# Altium schematic sheet Standby_PS.SchDoc
size A1; SPICEModelCacheYQEDCYZF: <root> / <DocumentId>YQEDCYZF</DocumentId> / </root>
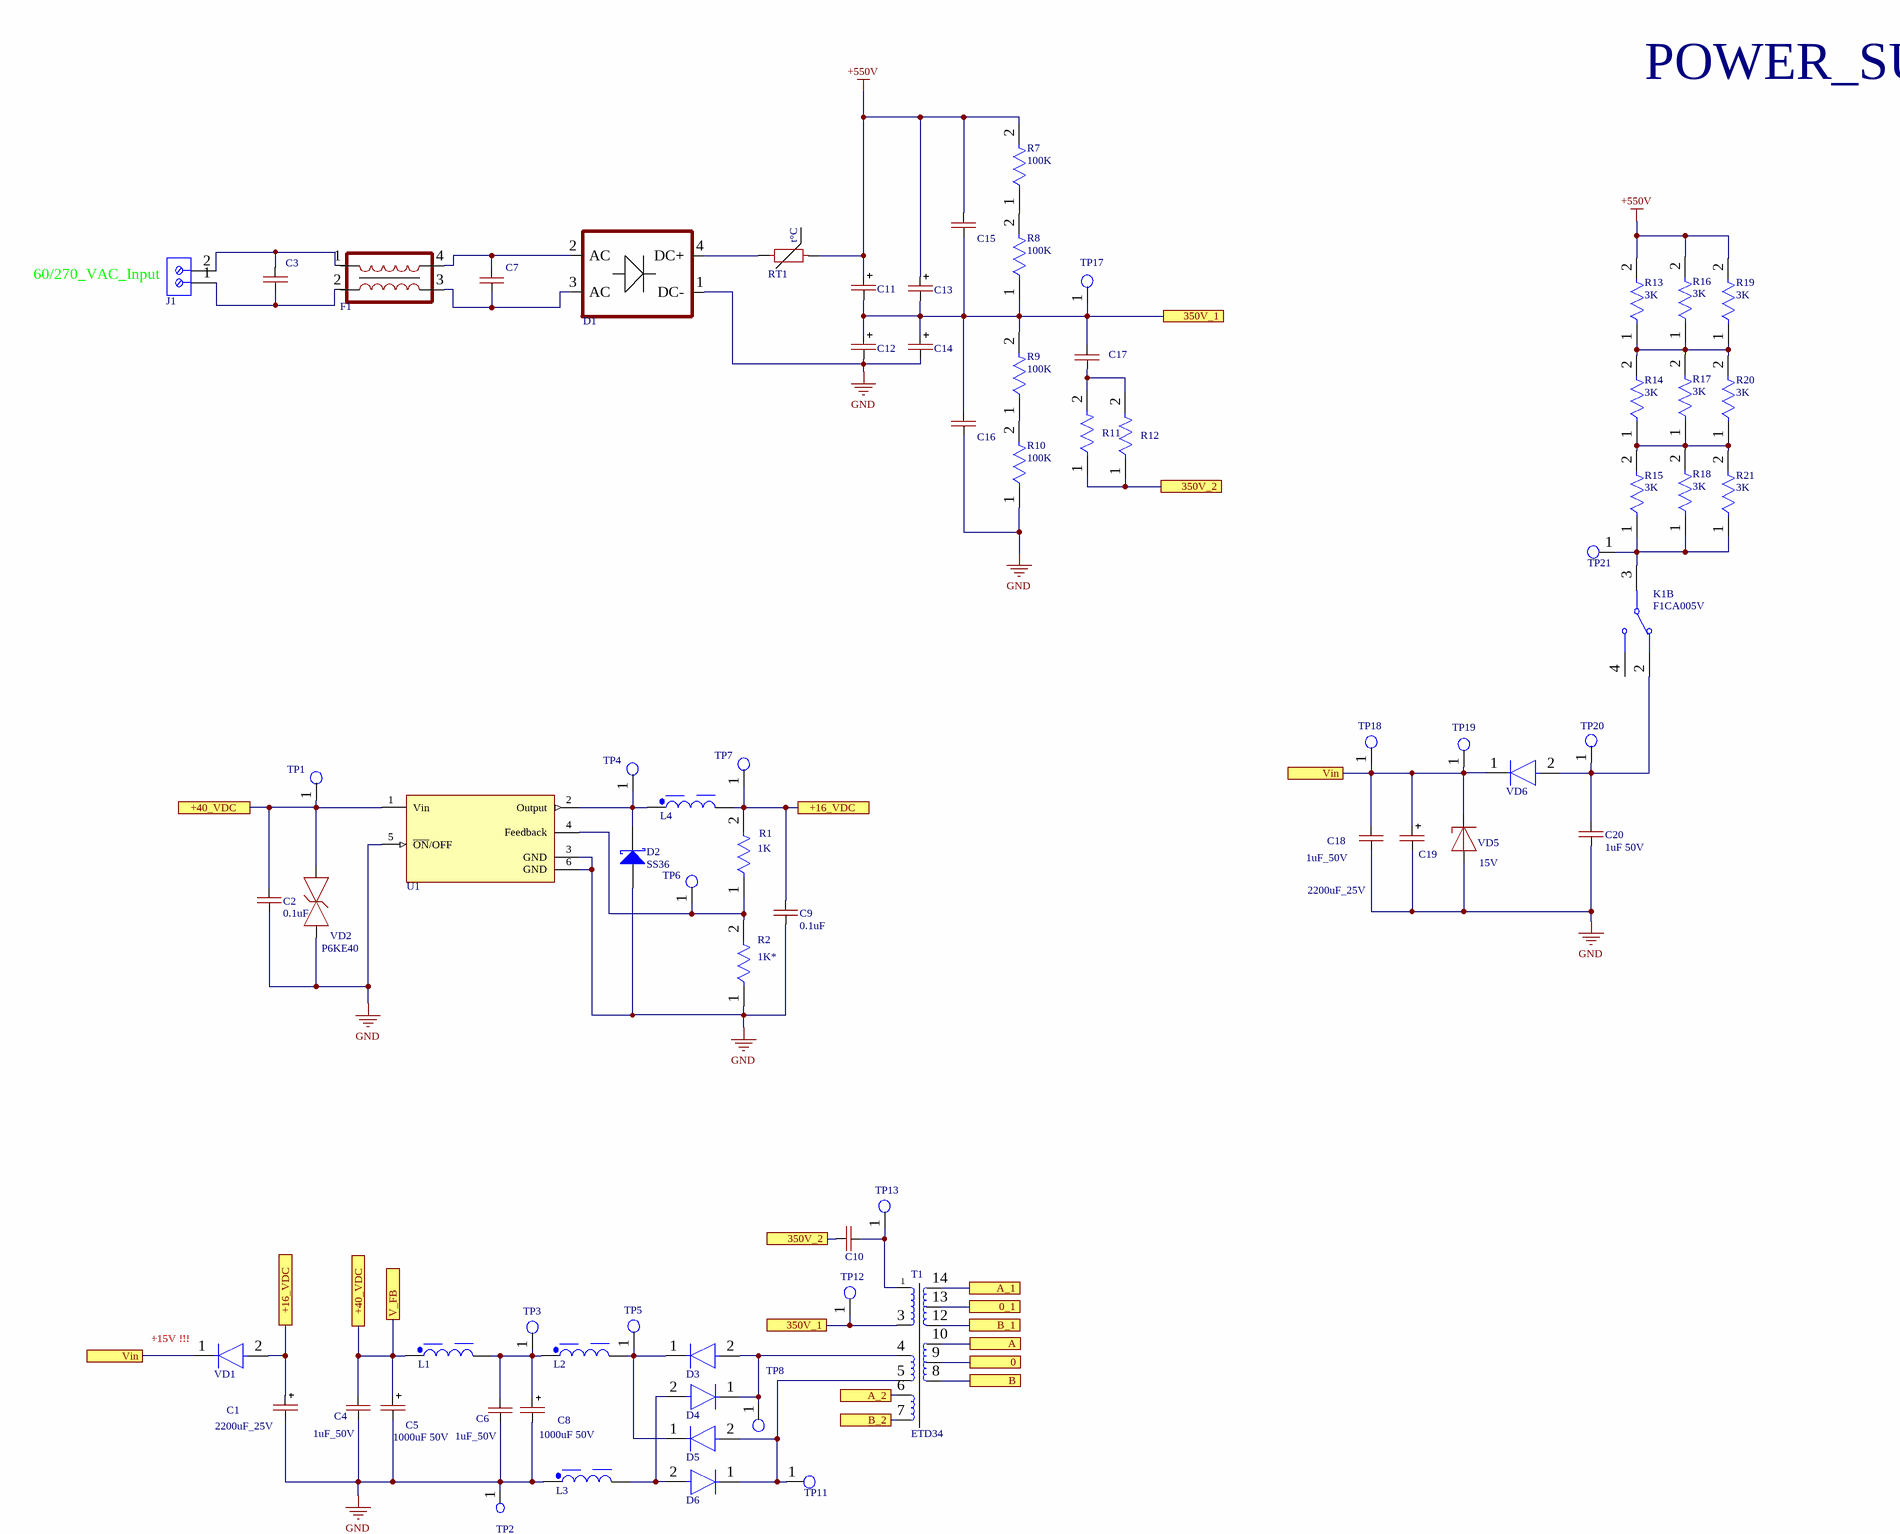
[diagram p0: Standby_PS.SchDoc, top left]
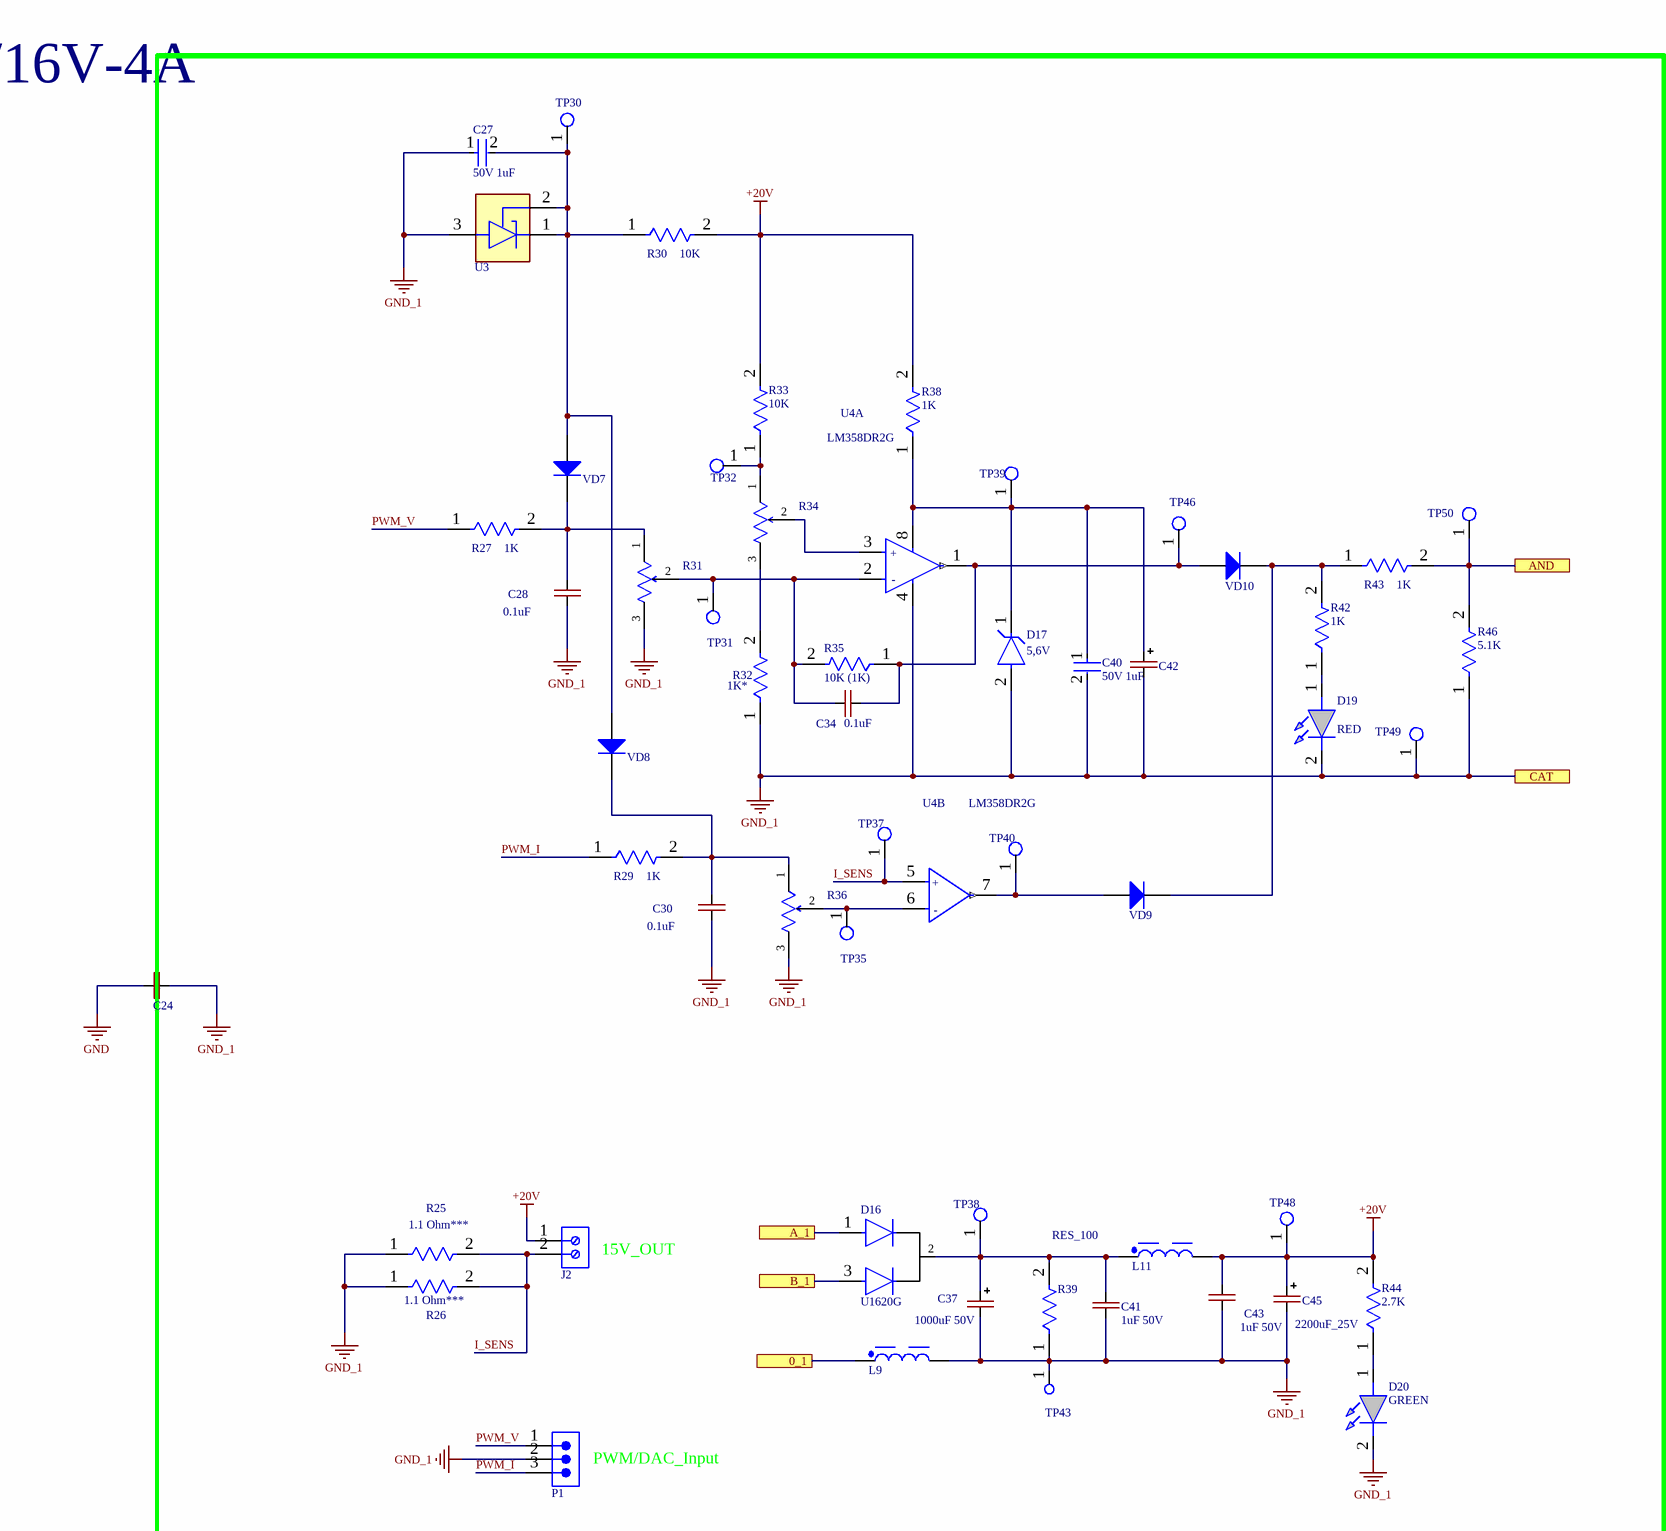
[diagram p1: Standby_PS.SchDoc, top right]
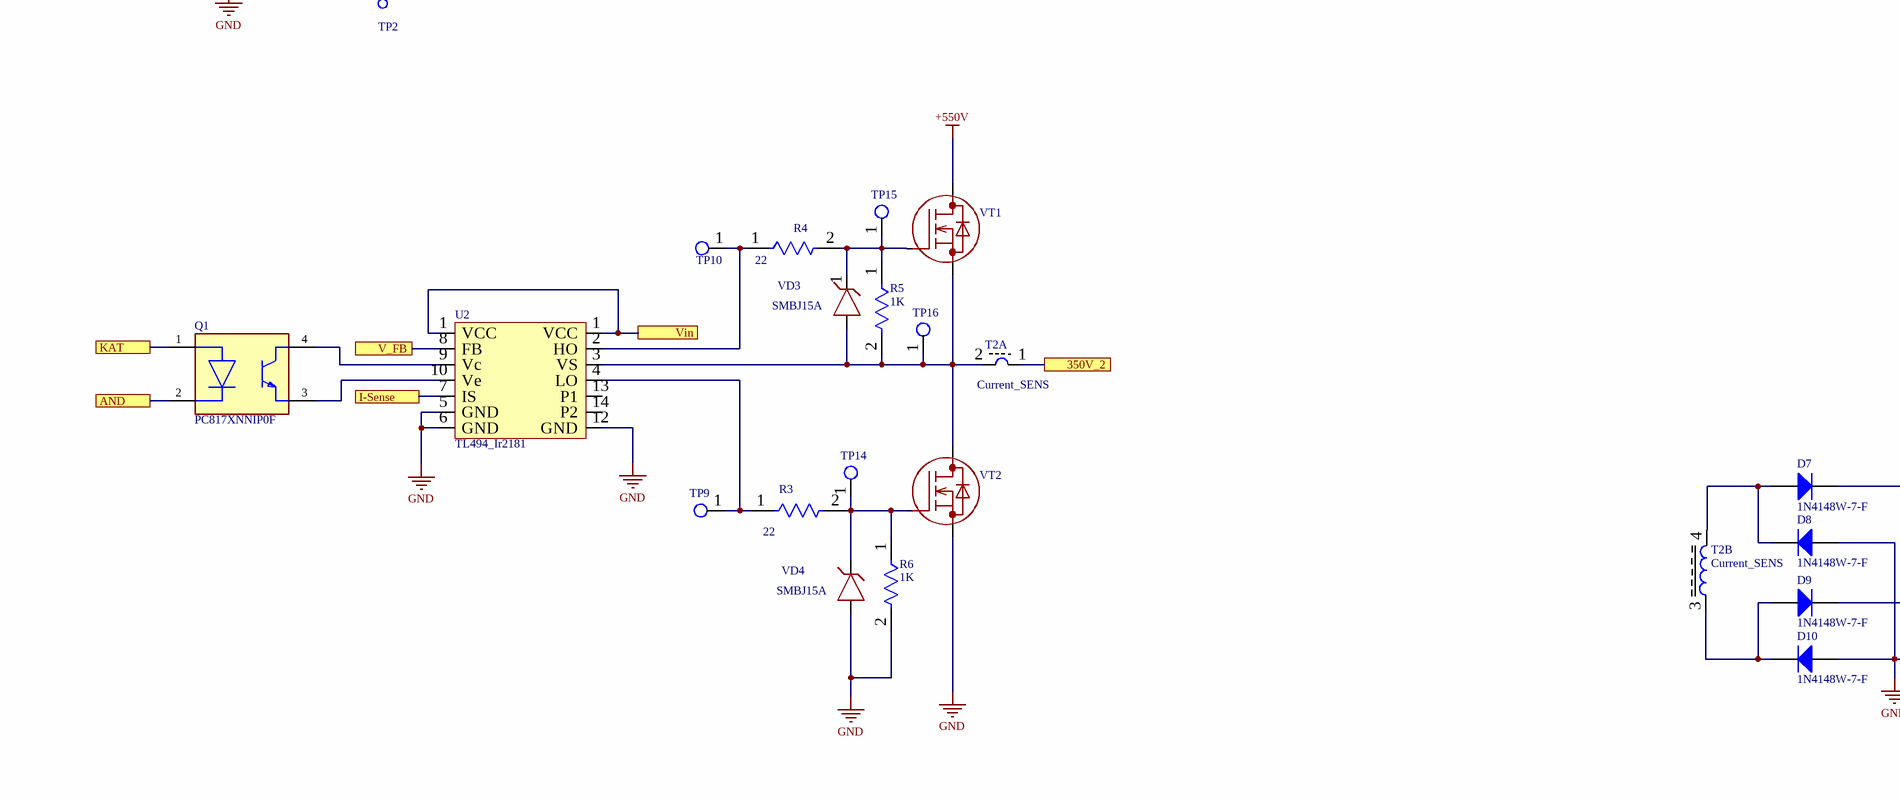
[diagram p2: Standby_PS.SchDoc, bottom left]
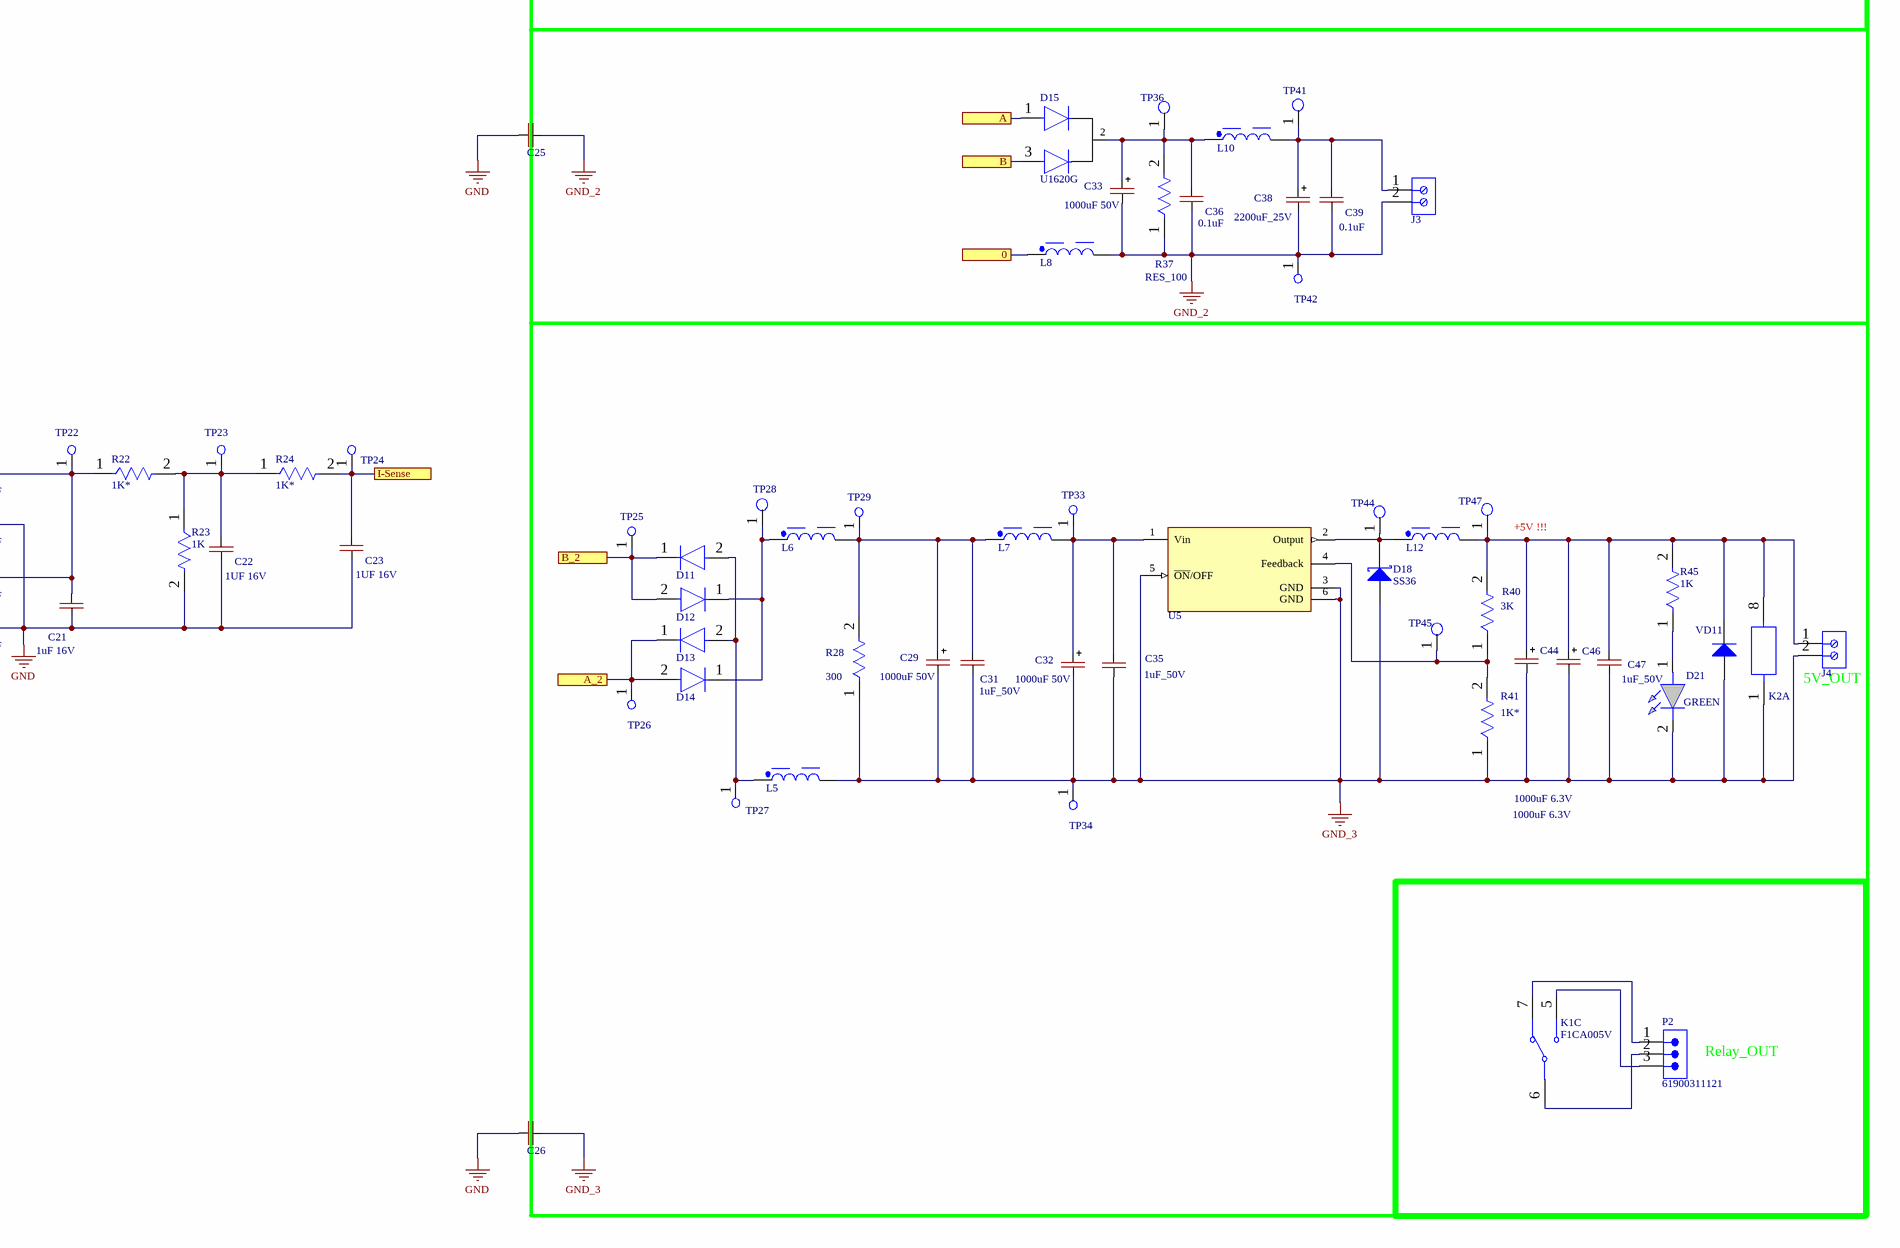
[diagram p3: Standby_PS.SchDoc, bottom right]

## Parts
C1  2200uF_25V  [CAP_POL_13x26_1000uF_50V]
C2  0.1uF  [CAP-0805]
C3  CAP-NON-POLAR  [CAP-V15]  (value not drawn)
C4  1uF_50V  [CAP-0805]
C5  1000uF 50V  [FP-RAD-TH-D_16_0_5-L_25_2-MFG]
C6  1uF_50V  [CAP-0805]
C7  CAP-NON-POLAR  [CAP-V15]  (value not drawn)
C8  1000uF 50V  [FP-RAD-TH-D_16_0_5-L_25_2-MFG]
C9  0.1uF  [CAP-0805]
C10  CAP-NON-POLAR  [CAP_3.3uF_630V]  (value not drawn)
C11  CAP-POLAR  [CAP 100uF_500V 22x40mm]  (value not drawn)
C12  CAP-POLAR  [CAP 100uF_500V 22x40mm]  (value not drawn)
C13  CAP-POLAR  [CAP 100uF_500V 22x40mm]  (value not drawn)
C14  CAP-POLAR  [CAP 100uF_500V 22x40mm]  (value not drawn)
C15  CAP-NON-POLAR  [CAP_3.3uF_630V]  (value not drawn)
C16  CAP-NON-POLAR  [CAP_3.3uF_630V]  (value not drawn)
C17  CAP-V  [CAP-V]  (value not drawn)
C18  1uF_50V  [CAP-0805]
C19  2200uF_25V  [CAP_POL_13x26_1000uF_50V]
C20  1uF 50V  [CAP-0805]
C21  1uF 16V  [CAP-0805]
C22  1UF 16V  [CAP-0805]
C23  1UF 16V  [CAP-0805]
C24  (no value)  [CAP-V]
C25  (no value)  [CAP-V]
C26  (no value)  [CAP-V]
C27  50V 1uF  [FP-C0805C-DN-IPC_A]
C28  0.1uF  [CAP-0805]
C29  1000uF 50V  [FP-RAD-TH-D_16_0_5-L_25_2-MFG]
C30  0.1uF  [CAP-0805]
C31  1uF_50V  [CAP-0805]
C32  1000uF 50V  [FP-RAD-TH-D_16_0_5-L_25_2-MFG]
C33  1000uF 50V  [FP-RAD-TH-D_16_0_5-L_25_2-MFG]
C34  0.1uF  [CAP-0805]
C35  1uF_50V  [CAP-0805]
C36  0.1uF  [CAP-0805]
C37  1000uF 50V  [FP-RAD-TH-D_16_0_5-L_25_2-MFG]
C38  2200uF_25V  [CAPPOL-12x25]
C39  0.1uF  [CAP-0805]
C40  50V 1uF  [FP-C0805C-DN-IPC_A]
C41  1uF 50V  [CAP-0805]
C42  CAP-POLAR  [CAP-TAN-C]  (value not drawn)
C43  1uF 50V  [CAP-0805]
C44  1000uF 6.3V  [CAP_SMD_Size_E]
C45  2200uF_25V  [CAPPOL-12x25]
C46  1000uF 6.3V  [CAP_SMD_Size_E]
C47  1uF_50V  [CAP-0805]
D1  RS40X  [RS40X]  (value not drawn)
D2  SS36  [SMC/DO214AB]
D3  US1G  [DO-214AA]  (value not drawn)
D4  US1G  [DO-214AA]  (value not drawn)
D5  US1G  [DO-214AA]  (value not drawn)
D6  US1G  [DO-214AA]  (value not drawn)
D7  1N4148W-7-F  [DIOD-SOD123-2_V]
D8  1N4148W-7-F  [DIOD-SOD123-2_V]
D9  1N4148W-7-F  [DIOD-SOD123-2_V]
D10  1N4148W-7-F  [DIOD-SOD123-2_V]
D11  US1G  [DO-214AA]  (value not drawn)
D12  US1G  [DO-214AA]  (value not drawn)
D13  US1G  [DO-214AA]  (value not drawn)
D14  US1G  [DO-214AA]  (value not drawn)
D15  U1620G  [TO-220_Bended_Rad]
D16  U1620G  [TO-220_Bended_Rad]
D17  5,6V  [FP-SB-V-3906_04-031_4-MFG]
D18  SS36  [SMC/DO214AB]
D19  RED  [LED_RED]
D20  GREEN  [LED_GREEN]
D21  GREEN  [LED_GREEN]
F1  FILTER  [FILTER_1]  (value not drawn)
J1  691101710002  [691101710002]  (value not drawn)
J2  691102710002  [691102710002]  (value not drawn)
J3  691102710002  [691102710002]  (value not drawn)
J4  691101710002  [691101710002]  (value not drawn)
K1  F1CA005V  [Relay_F1CA005V_Omron]  (parts B,C of 3)
K2  (no value)  [Relay_F1CA005V_Omron]  (part A of 3)
L1  1.2µH, 7.4A  [WE-PD2_1054]  (value not drawn)
L2  1.2µH, 7.4A  [WE-PD2_1054]  (value not drawn)
L3  1.2µH, 7.4A  [WE-PD2_1054]  (value not drawn)
L4  22µH, 2.04A  [WE-PD2_1054]  (value not drawn)
L5  1.2µH, 7.4A  [WE-PD2_1054]  (value not drawn)
L6  1.2µH, 7.4A  [WE-PD2_1054]  (value not drawn)
L7  1.2µH, 7.4A  [WE-PD2_1054]  (value not drawn)
L8  1.2µH, 7.4A  [WE-PD2_1054]  (value not drawn)
L9  1.2µH, 7.4A  [WE-PD2_1054]  (value not drawn)
L10  1.2µH, 7.4A  [WE-PD2_1054]  (value not drawn)
L11  1.2µH, 7.4A  [WE-PD2_1054]  (value not drawn)
L12  22µH, 2.04A  [WE-PD2_1054]  (value not drawn)
P1  61900311121  [61900311121]  (value not drawn)
P2  61900311121  [61900311121]
Q1  PC817XNNIP0F  [FP-PC817XNNIP0F-MFG]
R1  1K  [RES-0805]
R2  1K*  [RES-0805]
R3  22  [RES_SMD_1210_IPC_A]
R4  22  [RES_SMD_1210_IPC_A]
R5  1K  [RES-0805]
R6  1K  [RES-0805]
R7  100K  [RES-2512]
R8  100K  [RES-2512]
R9  100K  [RES-2512]
R10  100K  [RES-2512]
R11  RES_1210  [RES_SMD_1210_IPC_A]  (value not drawn)
R12  RES_1210  [RES_SMD_1210_IPC_A]  (value not drawn)
R13  3K  [RES-2512]
R14  3K  [RES-2512]
R15  3K  [RES-2512]
R16  3K  [RES-2512]
R17  3K  [RES-2512]
R18  3K  [RES-2512]
R19  3K  [RES-2512]
R20  3K  [RES-2512]
R21  3K  [RES-2512]
R22  1K*  [RES-0805]
R23  1K  [RES-0805]
R24  1K*  [RES-0805]
R25  1.1 Ohm***  [RES-2W_2]
R26  1.1 Ohm***  [RES-2W_2]
R27  1K  [RES-0805]
R28  300  [RES_3W]
R29  1K  [RES-0805]
R30  10K  [RES-0805]
R31  10K  [RES_Adj_3296W_Bourns]  (value not drawn)
R32  1K*  [RES-0805]
R33  10K  [RES-0805]
R34  10K  [RES_Adj_3296W_Bourns]  (value not drawn)
R35  10K (1K)  [RES-0805]
R36  10K  [RES_Adj_3296W_Bourns]  (value not drawn)
R37  RES_100  [RES_3W]
R38  1K  [RES-0805]
R39  RES_100  [RES_3W]
R40  3K  [RES-0805]
R41  1K*  [RES-0805]
R42  1K  [RES-0805]
R43  1K  [RES-0805]
R44  2.7K  [RES-0805]
R45  1K  [RES-0805]
R46  5.1K  [RES-0805]
RT1  RES-TEMP  [10D-15]  (value not drawn)
T1  ETD34  [Transformer_ETD34]
T2  Current_SENS  [Current_Sense_13x7x5]  (parts A,B of 2)
TP1  (no value)  [Test_Point]
TP2  Test_Point_PCB  [Pin_Test_Point(Orange)]  (value not drawn)
TP3  (no value)  [Test_Point]
TP4  (no value)  [Test_Point]
TP5  (no value)  [Test_Point]
TP6  (no value)  [Test_Point]
TP7  (no value)  [Test_Point]
TP8  (no value)  [Test_Point]
TP9  (no value)  [Test_Point]
TP10  (no value)  [Test_Point]
TP11  (no value)  [Test_Point]
TP12  (no value)  [Test_Point]
TP13  (no value)  [Test_Point]
TP14  (no value)  [Test_Point]
TP15  (no value)  [Test_Point]
TP16  (no value)  [Test_Point]
TP17  (no value)  [Test_Point]
TP18  (no value)  [Test_Point]
TP19  Test_Point_PCB  [Test_Point]  (value not drawn)
TP20  Test_Point_PCB  [Test_Point]  (value not drawn)
TP21  Test_Point_PCB  [Test_Point]  (value not drawn)
TP22  Test_Point_PCB  [Test_Point]  (value not drawn)
TP23  Test_Point_PCB  [Test_Point]  (value not drawn)
TP24  Test_Point_PCB  [Test_Point]  (value not drawn)
TP25  Test_Point_PCB  [Test_Point]  (value not drawn)
TP26  Test_Point_PCB  [Test_Point]  (value not drawn)
TP27  Test_Point_PCB  [Test_Point]  (value not drawn)
TP28  (no value)  [Test_Point]
TP29  Test_Point_PCB  [Test_Point]  (value not drawn)
TP30  Test_Point_PCB  [Test_Point]  (value not drawn)
TP31  Test_Point_PCB  [Test_Point]  (value not drawn)
TP32  Test_Point_PCB  [Test_Point]  (value not drawn)
TP33  Test_Point_PCB  [Test_Point]  (value not drawn)
TP34  Test_Point_PCB  [Pin_Test_Point(Orange)]  (value not drawn)
TP35  Test_Point_PCB  [Test_Point]  (value not drawn)
TP36  Test_Point_PCB  [Test_Point]  (value not drawn)
TP37  Test_Point_PCB  [Test_Point]  (value not drawn)
TP38  Test_Point_PCB  [Test_Point]  (value not drawn)
TP39  Test_Point_PCB  [Test_Point]  (value not drawn)
TP40  Test_Point_PCB  [Test_Point]  (value not drawn)
TP41  Test_Point_PCB  [Test_Point]  (value not drawn)
TP42  Test_Point_PCB  [Pin_Test_Point(Pink)]  (value not drawn)
TP43  Test_Point_PCB  [Pin_Test_Point(Pink)]  (value not drawn)
TP44  (no value)  [Test_Point]
TP45  (no value)  [Test_Point]
TP46  Test_Point_PCB  [Test_Point]  (value not drawn)
TP47  (no value)  [Test_Point]
TP48  Test_Point_PCB  [Test_Point]  (value not drawn)
TP49  Test_Point_PCB  [Test_Point]  (value not drawn)
TP50  Test_Point_PCB  [Test_Point]  (value not drawn)
U1  (no value)  [ON_Semiconductor_936A-02_MFG]
U2  TL494_Ir2181  [PWM_Controller_Half]
U3  (no value)  [TL431_SOT-23-3(A)]
U4  LM358DR2G  [FP-751-07-IPC_C]  (parts A,B of 2)
U5  (no value)  [ON_Semiconductor_936A-02_MFG]
VD1  US1G  [US1G_SMA]  (value not drawn)
VD2  P6KE40  [P6KE350CA]
VD3  SMBJ15A  [DO-214AA]
VD4  SMBJ15A  [DO-214AA]
VD5  15V  [DO-017AA]
VD6  US1G  [US1G_SMA]  (value not drawn)
VD7  (no value)  [DIOD-SOD123-2_V]
VD8  (no value)  [DIOD-SOD123-2_V]
VD9  (no value)  [DIOD-SOD123-2_V]
VD10  (no value)  [DIOD-SOD123-2_V]
VD11  (no value)  [DIOD-SOD123-2_V]
VT1  MOSFET-N-GDS  [RAD_TO-220-TO247]  (value not drawn)
VT2  MOSFET-N-GDS  [RAD_TO-220-TO247]  (value not drawn)

## Blocks framed on the sheet
Relay_OUT: K1 P2

## Ports
0, 0_1, 350V_1, 350V_2, +16_VDC, +40_VDC, A, A_1, A_2, AND, B, B_1, B_2, CAT, I-Sense, KAT, V_FB, Vin

## Nets
+20V: C43.2 C45.1(+) J2.1 L11.2 R30.2 R33.2 R38.2 R44.2 TP48.1(G9)
+550V: C11.1(+) C13.1(+) C15.2 R7.2 R13.2 R16.2 R19.2 RT1.1 VT1.2(D)
GND: C1.2(-) C2.1 C4.2 C5.2(-) C6.2 C8.2(-) C9.1 C12.2(-) C14.2(-) C16.1 C18.2 C19.2(-) C20.1 C21.1 C22.1 C23.1 C24.1 C25.1 C26.1 D1.1(DC-) D2.2(A) D8.2(A) D10.2(A) L3.1 R2.1 R6.2 R10.1 R23.2 TP2.1(G9) U1.3(GND) U1.5(~{ON}/OFF) U1.6(GND) U2.5(GND) U2.6(GND) U2.12(GND) VD2.1(C) VD4.2(A) VD5.2(A) VT2.3(S)
GND_1: C24.2 C27.1 C28.1 C30.1 C37.2(-) C40.2 C41.1 C42.2(-) C43.1 C45.2(-) D17.2(A) D19.2(K) D20.2(K) L9.2 P1.2 R25.1 R26.1 R31.3(CW) R32.1 R36.3(CW) R39.1 R46.1 TP43.1(G9) TP49.1(G9) U3.3(A) U4.4(VEE/GND) ; port CAT
GND_2: C25.2 C33.2(-) C36.1 C38.2(-) C39.1 J3.2 L8.2 R37.1 TP42.1(G9)
GND_3: C26.2 C29.2(-) C31.2 C32.2(-) C35.2 C44.2(-) C46.2(-) C47.2 D18.2(A) D21.2(K) J4.2 K2.1 L5.2 R28.1 R41.1 TP34.1(G9) U5.3(GND) U5.5(~{ON}/OFF) U5.6(GND) VD11.2(A)
0: L8.1 T1.9 ; port 0
0_1: L9.1 T1.13 ; port 0_1
350V_1: C11.2(-) C12.1(+) C13.2(-) C14.1(+) C15.1 C16.2 C17.2 R8.1 R9.2 T1.3 TP12.1(G9) TP17.1(G9) ; port 350V_1
350V_2: C10.1 R11.1 R12.1 T2.1 ; port 350V_2
+16_VDC: C1.1(+) C9.2 L4.2 R1.2 TP7.1(G9) VD1.2(A) ; port +16_VDC
+40_VDC: C2.2 C4.1 C5.1(+) L1.1 TP1.1(G9) U1.1(Vin) U2.8(FB) VD2.2(A) ; port V_FB, port +40_VDC
A: D15.1(A) T1.10 ; port A
A_1: D16.1(A) T1.14 ; port A_1
A_2: D13.1(C) D14.2(A) T1.6 TP26.1(G9) ; port A_2
AND: Q1.2(C) R43.2 R46.2 TP50.1(G9) ; port AND
B: D15.3(A) T1.8 ; port B
B_1: D16.3(A) T1.12 ; port B_1
B_2: D11.1(C) D12.2(A) T1.7 TP25.1(G9) ; port B_2
I-Sense: C23.2 R24.2 TP24.1(G9) U2.7(IS) ; port I-Sense
I_SENS: J2.2 R25.2 R26.2 TP37.1(G9) U4.5(INPUT_B+)
KAT: Q1.1(A) ; port KAT
PWM_I: P1.3 R29.1
PWM_V: P1.1 R27.1
Vin: C18.1 C19.1(+) TP18.1(G9) TP19.1(G9) U2.1(VCC) VD1.1(C) VD5.1(C) VD6.1(C) ; port Vin
NetC3_1: C3.1 F1.2 J1.1
NetC3_2: C3.2 F1.1 J1.2
NetC6_1: C6.1 C8.1(+) L1.2 L2.1 TP3.1(G9)
NetC7_1: C7.1 D1.3(AC) F1.3
NetC7_2: C7.2 D1.2(AC) F1.4
NetC10_2: C10.2 T1.1 TP13.1(G9)
NetC17_1: C17.1 R11.2 R12.2
NetC20_2: C20.2 K1.2 TP20.1(G9) VD6.2(A)
NetC21_2: C21.2 D7.1(K) D9.1(K) R22.1 TP22.1(G9)
NetC22_2: C22.2 R22.2 R23.1 R24.1 TP23.1(G9)
NetC27_2: C27.2 R30.1 TP30.1(G9) U3.1(C) U3.2(REF) VD7.2(A) VD8.2(A)
NetC28_2: C28.2 R27.2 R31.1(CCW) VD7.1(K)
NetC29_1: C29.1(+) C31.1 L6.2 L7.1 R28.2 TP29.1(G9)
NetC30_2: C30.2 R29.2 R36.1(CCW) VD8.1(K)
NetC32_1: C32.1(+) C35.1 L7.2 TP33.1(G9) U5.1(Vin)
NetC33_1: C33.1(+) C36.2 D15.2(C) L10.1 R37.2 TP36.1(G9)
NetC34_1: C34.1 R35.1 TP46.1(G9) U4.1(OUTPUT_A) VD10.2(A)
NetC34_2: C34.2 R31.2(WIPER) R35.2 TP31.1(G9) U4.2(INPUT_A-)
NetC37_1: C37.1(+) C41.2 D16.2(C) L11.1 R39.2 TP38.1(G9)
NetC38_1: C38.1(+) C39.2 J3.1 L10.2 TP41.1(G9)
NetC40_1: C40.1 C42.1(+) D17.1(C) R38.1 TP39.1(G9) U4.8(VCC)
NetC44_1: C44.1(+) C46.1(+) C47.1 J4.1 K2.8 L12.2 R40.2 R45.2 TP47.1(G9) VD11.1(K)
NetD1_4: D1.4(DC+) RT1.2
NetD2_1: D2.1(K) L4.1 TP4.1(G9) U1.2(Output)
NetD3_1: D3.1(C) D5.1(C) L2.2 TP5.1(G9)
NetD3_2: D3.2(A) D4.1(C) T1.4 TP8.1(G9)
NetD4_2: D4.2(A) D6.2(A) L3.2
NetD5_2: D5.2(A) D6.1(C) T1.5 TP11.1(G9)
NetD7_2: D7.2(A) D8.1(K) T2.4
NetD9_2: D9.2(A) D10.1(K) T2.3
NetD11_2: D11.2(A) D13.2(A) L5.1 TP27.1(G9)
NetD12_1: D12.1(C) D14.1(C) L6.1 TP28.1(G9)
NetD18_1: D18.1(K) L12.1 TP44.1(G9) U5.2(Output)
NetD19_1: D19.1(A) R42.1
NetD20_1: D20.1(A) R44.1
NetD21_1: D21.1(A) R45.1
NetK1_3: K1.3 R15.1 R18.1 R21.1 TP21.1(G9)
NetK1_5: K1.5 P2.3
NetK1_6: K1.6 P2.2
NetK1_7: K1.7 P2.1
NetQ1_3: Q1.3(E) U2.10(Ve)
NetQ1_4: Q1.4(C) U2.9(Vc)
NetR1_1: R1.1 R2.2 TP6.1(G9) U1.4(Feedback)
NetR3_1: R3.1 TP9.1(G9) U2.4(LO)
NetR3_2: R3.2 R6.1 TP14.1(G9) VD4.1(C) VT2.1(G)
NetR4_1: R4.1 TP10.1(G9) U2.2(HO)
NetR4_2: R4.2 R5.1 TP15.1(G9) VD3.1(C) VT1.1(G)
NetR5_2: R5.2 T2.2 TP16.1(G9) U2.3(VS) VD3.2(A) VT1.3(S) VT2.2(D)
NetR7_1: R7.1 R8.2
NetR9_1: R9.1 R10.2
NetR13_1: R13.1 R14.2 R16.1 R17.2 R19.1 R20.2
NetR14_1: R14.1 R15.2 R17.1 R18.2 R20.1 R21.2
NetR32_2: R32.2 R34.3(CW)
NetR33_1: R33.1 R34.1(CCW) TP32.1(G9)
NetR34_2: R34.2(WIPER) U4.3(INPUT_A+)
NetR36_2: R36.2(WIPER) TP35.1(G9) U4.6(INPUT_B-)
NetR40_1: R40.1 R41.2 TP45.1(G9) U5.4(Feedback)
NetR42_2: R42.2 R43.1 VD9.1(K) VD10.1(K)
NetTP40_1: TP40.1(G9) U4.7(OUTPUT_B) VD9.2(A)

Not connected (* = marked no-connect by the designer): K1 4; U2 13(P1) 14(P2)

## Notes on the sheet
- POWER_SUPPLY 60-350V/16V-4A
- (near J1) 60/270_VAC_Input
- (near J2) 15V_OUT
- (near VD1) +15V !!!
- (near P1) PWM/DAC_Input
- (near TP47) +5V !!!
- (near J4) 5V_OUT
- (in symbol CMP-1310-00291-2, part A) +; -
- (in symbol CMP-1310-00291-2, part B) +; -
- (in symbol RES-TEMP) t°C

## Library data of the parts
C1 C19 = CAP_polar_Hitano
C2 C4 C6 C9 C18 C20-C23 C28 C30 C31 C34-C36 C39 C41 C43 C47 = CAP-NON-POLAR
C5 C8 C29 C32 C33 C37 C38 C45 = CAP-POLAR
C24-C26 = CAP-V
C27 C40 = CMP-1036-04552-2: CAP CER 0.22UF 50V X7R 0805; Manufacturer: KEMET; Manufacturer Part Number: C0805C224K5RACTU; Value: 0.22 μF; Temperature Coefficient: 30ppm/°C; Material: Ceramic; Tolerance: 0.1; ComponentLink2URL: https://content.kemet.com/datasheets/KEM_C1003_C0G_SMD.pdf; Temperature Characteristic: X7R; Device Class L3: Ceramic Capacitors; Lead Free: Yes; Temperature: -55°C to +125°C; RoHS: TRUE; Capacitance: 0.22 μF; Automotive: No; Octopart: https://octopart.com/c0805c224k5ractu-kemet-144670; Temperature Range Low: -55°C; Height: 0.88mm; Device Class L1: Passive Components; Digikey Description: CAP CER 0.22UF 50V X7R 0805; ComponentLink2Description: Datasheet; Mouser Description: CAP CER 0.22UF 50V X7R 0805; Category: Cap; Ipc Land Pattern Name: CAPC200125X78; Temperature Range High: +125°C; Package: C0805C-DN; Device Class L2: Capacitors; Voltage Rating: 50 V
C44 C46 = CAP_POL_SMD
D2 D18 = SS36_Schottky
D7-D10 VD7-VD11 = 1N4148: Fast Switching Diode, 100 V, 0.15 A, -65 to 150 degC, 2-Pin?SOD123, RoHS, Tape and Reel; Recovery Time: 4ns; Brand: DiodesIncorporated; Unit Weight: 0.000353oz; Max Surge Current: 2A; Peak Reverse Voltage: 100V; Ir - Reverse Current: 1uA; Vf - Forward Voltage: 1.25V; Configuration: Single; If - Forward Current: 0.15A; Product Category: Diodes-GeneralPurpose,Power,Switching; Operating Temperature Range: -65Cto+150C; Packaging: Reel; Manufacturer URL: http://www.diodes.com/; Maximum Operating Temperature: +150C; Height: 1.25mm; Minimum Operating Temperature: -65C; Product: SwitchingDiodes; Package URL: http://www.diodes.com/datasheets/ds18004.pdf; Type: SwitchingDiode; Package Reference: SOD123-2; Width: 1.7mm; Datasheet URL: http://www.farnell.com/datasheets/1915529.pdf; Datasheet Version: Rev. 24-2, 10/2013; Series: 1N4148; Factory Pack Quantity: 3000; Length: 2.85mm; RoHS: True; Manufacturer: DiodesIncorporated; Mounting Style: SMD/SMT; Package / Case: SOD-123
D17 = CMP-02541-000026-1: DIODE ZENER 8.2V 500MW DO35; Test Current: 5mA; Tolerance: 2%; Impedance: 7R; ESD Protection: No; Element Configuration: Single; Max Reverse Leakage Current: 100nA; Packaging: Ammo Pack; Case/Package: DO-35; Lead Free: Lead Free; Number of Pins: 2; Min Operating Temperature: -65°C; Contact Plating: Tin; Max Power Dissipation: 500mW; Radiation Hardening: No; Max Operating Temperature: 175°C; Mount: Through Hole; Package Quantity: 30000; Voltage Tolerance: 2%; Series: Automotive, AEC-Q101; Zener Voltage: 8.2V; RoHS Compliant: Yes; Power Dissipation: 500mW
D19-D21 = LED: WURTH ELEKTRONIK - 151031YS06000 - LED, Yellow, Through Hole, T-1 (3mm), 30 mA, 2 V, 590 nm; Geometry.Height: 5.5mm; Manufacturer_Name: Wurth Elektronik; Manufacturer_Part_Number: 151031YS06000; Mouser Part Number: 710-151031YS06000; Mouser Price/Stock: https://www.mouser.co.uk/ProductDetail/Wurth-Elektronik/151031YS06000?qs=LlUlMxKIyB3xSYYW%252BcuBiQ%3D%3D; Arrow Part Number: *; Arrow Price/Stock: *; Mouser Testing Part Number: *; Mouser Testing Price/Stock: *; Datasheet Link: https://katalog.we-online.de/led/datasheet/151031YS06000.pdf
J1 J4 = 691101710002: WR-TBL Series 101 Horizontal Entry Modular, THT, pitch 5mm, 2p; Manufacturer: Wurth Elektronik; Modularity: Yes; Rated Current: 16A; Working Voltage: 250V; ComponentLink1Description: Website Link; ComponentLink1URL: https://www.we-online.com/redexpert/article/691101710002?ad; ComponentLink2Description: Datasheet Link; ComponentLink2URL: https://www.we-online.com/redexpert/spec/691101710002?ad; Manufacturer Part Number: 691101710002; Category: Terminal Blocks; Match Code: WR-TBL; Mount: Through Hole; Operating Temperature Max: 105°C; Operating Temperature Min: -40°C; Packaging: Box; Application: Pressure Clamp; Number of Pins: 2; Number of Rows: 1; Orientation: Horizontal; Pitch: 5mm
J2 J3 = 691102710002: WR-TBL Series 102 Horizontal Entry Modular, THT, pitch 5mm, 2p; Manufacturer: Wurth Elektronik; Modularity: Yes; Rated Current: 15A; Working Voltage: 250V; ComponentLink1Description: Website Link; ComponentLink1URL: https://www.we-online.com/redexpert/article/691102710002?ad; ComponentLink2Description: Datasheet Link; ComponentLink2URL: https://www.we-online.com/redexpert/spec/691102710002?ad; Manufacturer Part Number: 691102710002; Category: Terminal Blocks; Match Code: WR-TBL; Mount: Through Hole; Operating Temperature Max: 105°C; Operating Temperature Min: -40°C; Packaging: Box; Application: Pressure Clamp; Number of Pins: 2; Number of Rows: 1; Orientation: Horizontal; Pitch: 5mm
K2 = F1CA005V
L1-L3 L5-L11 = 744776012: WE-PD2 SMT Power Inductor, size 1054, 1.2µH, 7.4A, 0.006Ω; Manufacturer: Wurth Elektronik; Case/Size Code: 1054; DC Resistance: 0.004Ω; Saturation Current: 11A; Self Resonant Frequency: 110MHz; Manufacturer Part Number: 744776012; Category: Unshielded Power Inductors; Match Code: WE-PD2; ComponentLink1Description: Website Link; ComponentLink1URL: https://www.we-online.com/redexpert/article/744776012?ad; ComponentLink2Description: Datasheet Link; ComponentLink2URL: https://www.we-online.com/redexpert/spec/744776012?ad; Mount: Surface Mount; Operating Temperature Max: 125°C; Operating Temperature Min: -40°C; Packaging: Tape and Reel; Length: 10mm; Width: 9mm; Height: 5.4mm; DC Resistance Max: 0.006Ω; Inductance: 1.2µH; Rated Current: 7.4A
L4 L12 = 744776122: WE-PD2 SMT Power Inductor, size 1054, 22µH, 2.04A, 0.1Ω; Manufacturer: Wurth Elektronik; Case/Size Code: 1054; DC Resistance: 0.051Ω; Saturation Current: 2.07A; Self Resonant Frequency: 16MHz; Manufacturer Part Number: 744776122; Category: Unshielded Power Inductors; Match Code: WE-PD2; ComponentLink1Description: Website Link; ComponentLink1URL: https://www.we-online.com/redexpert/article/744776122?ad; ComponentLink2Description: Datasheet Link; ComponentLink2URL: https://www.we-online.com/redexpert/spec/744776122?ad; Mount: Surface Mount; Operating Temperature Max: 125°C; Operating Temperature Min: -40°C; Packaging: Tape and Reel; Length: 10mm; Width: 9mm; Height: 5.4mm; DC Resistance Max: 0.1Ω; Inductance: 22µH; Rated Current: 2.04A
P1 = 61900311121: WR-WTB THT Male Vertical Locking Header, pitch 2.54mm, 3pins; Manufacturer: Wurth Elektronik; Contact Resistance: 20mΩ; Rated Current: 3A; Working Voltage: 250VAC; Withstanding Voltage: 1000VAC; ComponentLink1Description: Website Link; ComponentLink1URL: https://www.we-online.com/redexpert/article/61900311121?ad; ComponentLink2Description: Datasheet Link; ComponentLink2URL: https://www.we-online.com/redexpert/spec/61900311121?ad; Manufacturer Part Number: 61900311121; Category: Wire-to-Board Connectors; Match Code: WR-WTB; Mount: Through Hole; Operating Temperature Max: 105°C; Operating Temperature Min: -40°C; Packaging: Bag; Length: 7.62mm; Width: 5.8mm; Height: 11.5mm; Gender: Male; Number of Pins: 3; Number of Rows: 1; Orientation: Vertical; Pitch: 2.54mm
P2 = 61900311121: WR-WTB THT Male Vertical Locking Header, pitch 2.54mm, 3pins; Manufacturer: Wurth Elektronik; Contact Resistance: 20mΩ; Rated Current: 3A; Withstanding Voltage: 1000VAC; Working Voltage: 250VAC; ComponentLink1Description: Website Link; ComponentLink1URL: https://www.we-online.com/redexpert/article/61900311121?ad; ComponentLink2Description: Datasheet Link; ComponentLink2URL: https://www.we-online.com/redexpert/spec/61900311121?ad; Pitch: 2.54mm; Packaging: Bag; Gender: Male; Manufacturer Part Number: 61900311121; Category: Wire-to-Board Connectors; Match Code: WR-WTB; Mount: Through Hole; Operating Temperature Max: 105°C; Operating Temperature Min: -40°C; Length: 7.62mm; Width: 5.8mm; Height: 11.5mm; Number of Pins: 3; Number of Rows: 1; Orientation: Vertical
Q1 = CMP-65434-000005-1: OPTOISOLATOR 5KV TRANS 4SMD; Reverse Breakdown Voltage: 6V; Output Current per Channel: 30mA; Power Dissipation: 200mW; Collector-emitter Voltage-Max: 200mV; Max Output Voltage: 80V; Input Current: 50mA; Forward Voltage: 1.4V; Fall Time: 18000ns; Number of Elements: 1; Input Type: DC; Packaging: Tape and Reel; RoHS Compliant: Yes; Contact Plating: Copper; Min Operating Temperature: -30°C; Collector Emitter Saturation Voltage: 200mV; Max Input Current: 50mA; Radiation Hardening: No; Max Collector Current: 50mA; Case/Package: SMD/SMT; Mount: Surface Mount; Output Voltage: 80V; Forward Current: 50mA; Max Power Dissipation: 200mW; Collector Emitter Voltage (VCEO): 80V; Number of Channels: 1; Rise Time: 18000ns; Isolation Voltage: 5kV; Number of Pins: 4; Lead Free: Lead Free; Package Quantity: 2000; Isolation Voltage-Max: 5kV; Max Operating Temperature: 100°C
R1 R5-R10 R13-R24 R27 R29 R30 R38 R42-R46 = RES-CONST
R2 R40 R41 = RES-CONST: 1K
R3 R4 = RES_1210
R25 R26 R35 = RES-CONST: 10K
R28 R37 R39 = RES_THT
R31 R34 R36 = RES_Adj
R32 R33 = RES-CONST: 1-K
TP1-TP50 = TP_PCB?: Test_Point
U1 U5 = LM2576D2T-005G
U2 = Half_Bridge_PWM
U3 = TL431_SOT-23-3
U4 = CMP-1310-00291-2: IC OPAMP GP 2 CIRCUIT 8SOIC; Gain Bandwidth Product: 1MHz; Number of Circuits: 2; Min Supply Voltage: 3V; Slew Rate: 0.6V/µs; Max Dual Supply Voltage: 16V; Common Mode Rejection Ratio: 65dB; Input Bias Current: 250nA; Min Dual Supply Voltage: 1.5V; Dual Supply Voltage: 9V; Operating Supply Current: 1.5mA; Output Current: 40mA; Input Offset Voltage (Vos): 7mV; Nominal Supply Current: 1.2mA; Voltage Gain: 100dB; Max Supply Voltage: 32V; Width: 4mm; Number of Pins: 8; Min Operating Temperature: 0°C; REACH SVHC: No SVHC; Contact Plating: Tin; Lead Free: Lead Free; Halogen Free: Halogen Free; Power Supply Rejection Ratio (PSRR): 65dB; Operating Supply Voltage: 16V; Package Quantity: 2500; Max Operating Temperature: 70°C; Case/Package: SOIC; Height: 1.5mm; Packaging: Tape and Reel; Radiation Hardening: No; Number of Channels: 2; Bandwidth: 1MHz; Length: 5mm; Number of Elements: 2; Number of Amplifiers: 2; Output Current per Channel: 40mA
VD2 = Suppressor
VD3 VD4 = ESD_Unidirect
VD5 = ZENER